# EAGLE design smartstand-clock-source-rev-a (EAGLE 7.3.0)
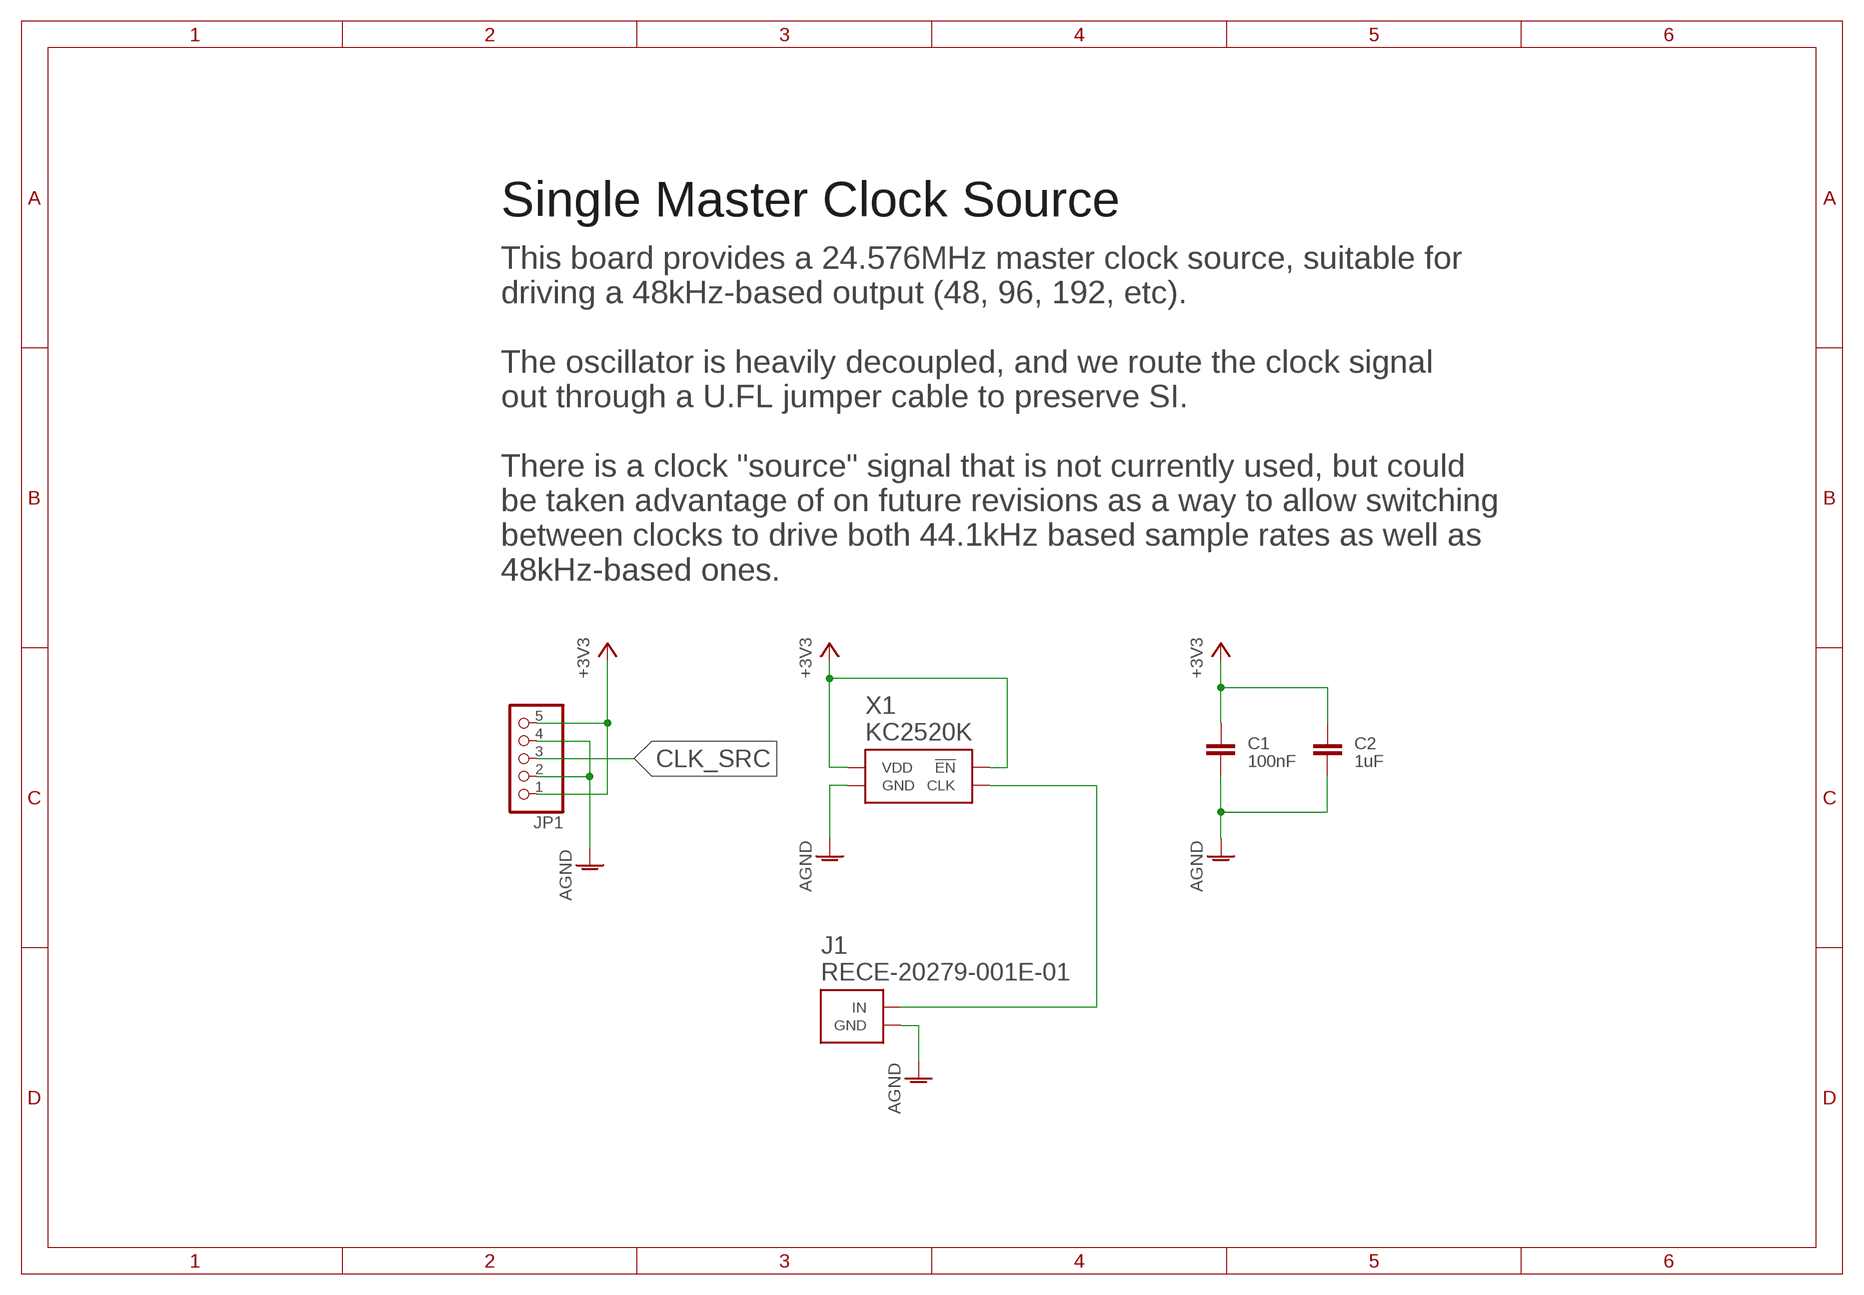
[diagram p0: schematic, sheet 1]

## Parts
C1  100nF  C-EUC0402  [C0402]
C2  1uF  C-EUC0603  [C0603]
J1  RECE-20279-001E-01  [IPEX-MHF]
JP1  PINHD-1X5  [1X05]
X1  KC2520K  [KC2520C]

## Nets
+3V3: C1.1 C2.1 JP1.1 JP1.5 X1.P$1(!EN) X1.P$4(VDD)
AGND: C1.2 C2.2 J1.P$1(GND) J1.P$2(GND) JP1.2 JP1.4 X1.P$2(GND)
CLK_SRC: JP1.3
N$1: J1.P$3(IN) X1.P$3(CLK)

## Notes on the sheet
- Single Master Clock Source
- This board provides a 24.576MHz master clock source, suitable for
  driving a 48kHz-based output (48, 96, 192, etc).
  
  The oscillator is heavily decoupled, and we route the clock signal
  out through a U.FL jumper cable to preserve SI.
  
  There is a clock "source" signal that is not currently used, but could
  be taken advantage of on future revisions as a way to allow switching
  between clocks to drive both 44.1kHz based sample rates as well as
  48kHz-based ones.

## Library data of the parts
C1 = passives:C-EU: CAPACITOR, European symbol; PN: GRM155R71C104KA88D
C2 = passives:C-EU: CAPACITOR, European symbol; PN: GRM188R61C105KA93D
J1 = taoglas:RECE-20279-001E-01; PN: RECE-20279-001E-01
JP1 = pin-headers:PINHD-1X5: PIN HEADER; PN: 90120-0125
X1 = crystals:KC2520K: Clock Oscillators, CMOS, 1.8V/2.5V/3.3V Compatible, 2.5×2.0mm; PN: KC3225K24.5760C1GE00

## Board
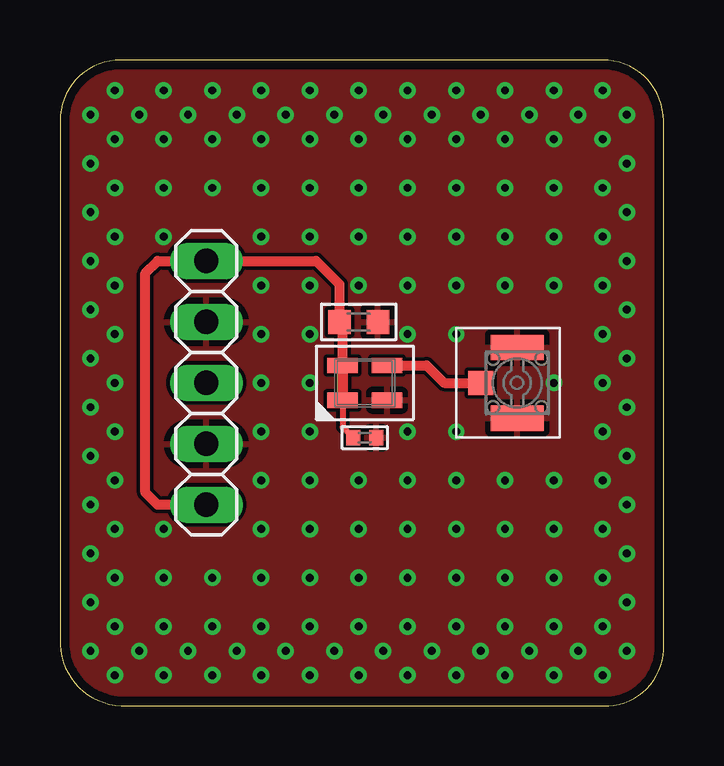
[diagram p1: board, top side]
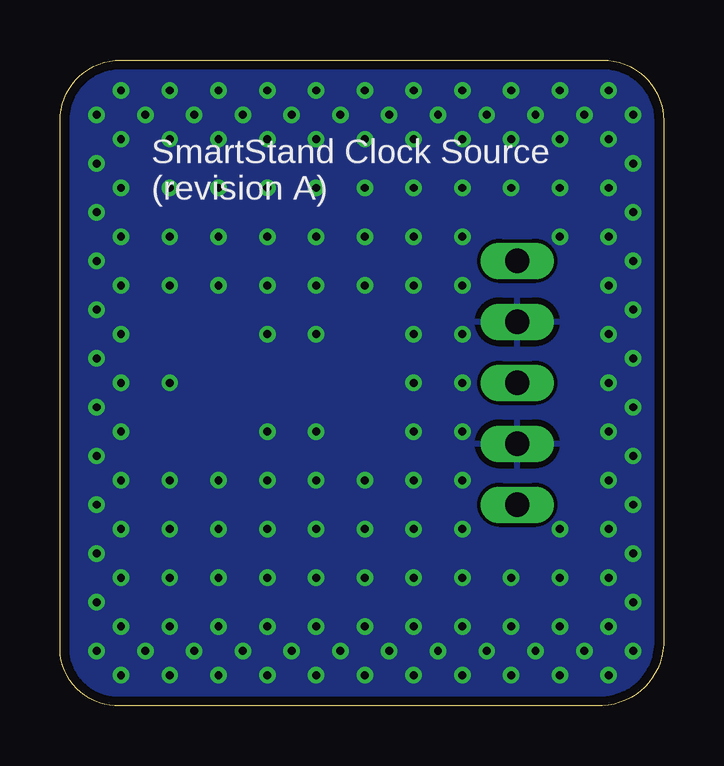
[diagram p2: board, bottom side, seen from below]

Size 25.15 x 26.92 mm. Coordinates in mm from the lower left corner, seen from the top.
Outline: 0,24.38 0,2.54 arc90 2.79,0 22.86,0 arc90 25.15,2.54 25.15,24.38 arc90 22.61,26.92 2.54,26.92 arc90 0,24.38
Copper layers (1*16): Top 0.035559375mm / dielectric 60mil / Bottom 0.035559375mm
Design rules "OSHPark-2Layer": minimum track width 6mil, minimum drill 13mil, track to track 6mil, track to pad 6mil, pad to pad 6mil, via to via 6mil, smd to smd 6mil, copper to edge 15mil, drill to drill 6mil, minimum pad ring 7mil, minimum via ring 7mil, stop-mask expansion 3mil, vias tented up to drill 14mil, thermal gap 10mil

### Footprints (pad centres in the part's own frame; a part is rotated, then mirrored left to right if it is on the bottom)
C0402 = smd 0.59 x 0.64: 1 -0.48,0; 2 0.48,0
C0603 = smd 0.95 x 1: 1 -0.8,0; 2 0.8,0
IPEX-MHF = smd 2.2 x 1.05: P$1 0,1.475; P$2 0,-1.475 | smd 1.05 x 1: P$3 1.525,0
1X05 = drill 1.016 long: 1 -5.08,0; 2 -2.54,0; 3 0,0; 4 2.54,0; 5 5.08,0
KC2520C = smd 1.27 x 0.635: P$1 -0.925,-0.725; P$2 0.925,-0.725; P$3 0.925,0.725; P$4 -0.925,0.725

### Placement (x,y rotation side)
C1  12.7,11.18 0 top
C2  12.45,16 0 top
J1  19.05,13.46 180 top
JP1  6.1,13.46 90 top
X1  12.7,13.46 0 top

### Tracks (layer width: path | path; a pad name or v marks a point on that pad's centre or on a via)
+3V3
  Top 0.254: X1.P$1 11.78,11.62 C1.1
  Top 0.406: JP1.1 4.06,8.38 3.56,8.89 3.56,18.03 4.06,18.54 JP1.5 10.67,18.54 11.65,17.56 C2.1 11.78,15.87 X1.P$4 X1.P$1
AGND  (via drill 0.33)
  other vias: 2.29,19.56 2.29,17.53 2.29,15.49 2.29,13.46 2.29,11.43 2.29,9.4 2.29,7.37 4.32,19.56 4.32,7.37 8.38,19.56 10.41,19.56 12.45,19.56 14.48,19.56 16.51,19.56 18.54,19.56 20.57,19.56 8.38,7.37 10.41,7.37 12.45,7.37 10.41,9.4 14.48,7.37 14.48,9.4 16.51,7.37 16.51,9.4 18.54,7.37 18.54,9.4 20.57,9.4 20.57,7.37 20.57,17.53 18.54,17.53 16.51,17.53 14.48,17.53 1.27,18.54 1.27,16.51 1.27,14.48 1.27,12.45 1.27,10.41 1.27,8.38 2.29,21.59 2.29,23.62 4.32,23.62 4.32,21.59 12.45,9.4 23.62,2.29 23.62,4.32 23.62,16.51 23.62,14.48 23.62,12.45 23.62,10.41 23.62,8.38 23.62,6.35 22.61,19.56 22.61,17.53 22.61,15.49 22.61,13.46 22.61,11.43 22.61,9.4 22.61,7.37 22.61,5.33 22.61,3.3 2.29,1.27 22.61,1.27 20.57,1.27 18.54,1.27 16.51,1.27 4.32,1.27 6.35,1.27 8.38,1.27 10.41,1.27 12.45,1.27 14.48,1.27 2.29,3.3 2.29,5.33 4.32,3.3 6.35,3.3 8.38,3.3 10.41,3.3 12.45,3.3 14.48,3.3 16.51,3.3 18.54,3.3 20.57,3.3 20.57,5.33 18.54,5.33 16.51,5.33 14.48,5.33 12.45,5.33 10.41,5.33 8.38,5.33 6.35,5.33 4.32,5.33 2.29,25.65 22.61,25.65 4.32,25.65 6.35,25.65 8.38,25.65 10.41,25.65 12.45,25.65 14.48,25.65 16.51,25.65 18.54,25.65 20.57,25.65 22.61,23.62 22.61,21.59 20.57,21.59 18.54,21.59 16.51,21.59 14.48,21.59 12.45,21.59 10.41,21.59 8.38,21.59 6.35,21.59 20.57,23.62 18.54,23.62 16.51,23.62 14.48,23.62 12.45,23.62 10.41,23.62 8.38,23.62 6.35,23.62 1.27,20.57 1.27,22.61 1.27,24.64 23.62,24.64 23.62,22.61 23.62,20.57 23.62,18.54 1.27,6.35 1.27,4.32 1.27,2.29 3.3,24.64 5.33,24.64 7.37,24.64 9.4,24.64 11.43,24.64 13.46,24.64 15.49,24.64 17.53,24.64 19.56,24.64 21.59,24.64 21.59,2.29 19.56,2.29 17.53,2.29 15.49,2.29 13.46,2.29 11.43,2.29 9.4,2.29 7.37,2.29 5.33,2.29 3.3,2.29 10.41,17.53 10.41,15.49 14.48,11.43 10.41,11.43 8.38,11.43 12.45,17.53 8.38,9.4 8.38,13.46 8.38,15.49 8.38,17.53 10.41,13.46 14.48,15.49 16.51,15.49 16.51,11.43 20.57,13.46
  pour Bottom: 22.86,0 2.79,0 arc-90 0,2.54 0,24.38 arc-90 2.54,26.92 22.61,26.92 arc-90 25.15,24.38 25.15,2.54 arc-90
  pour Top: 22.86,0 2.79,0 arc-90 0,2.54 0,24.38 arc-90 2.54,26.92 22.61,26.92 arc-90 25.15,24.38 25.15,2.54 arc-90
N$1
  Top 0.406: X1.P$3 15.28,14.19 16,13.46 J1.P$3

### Text on the board
bNames: SmartStand Clock Source / (revision A)